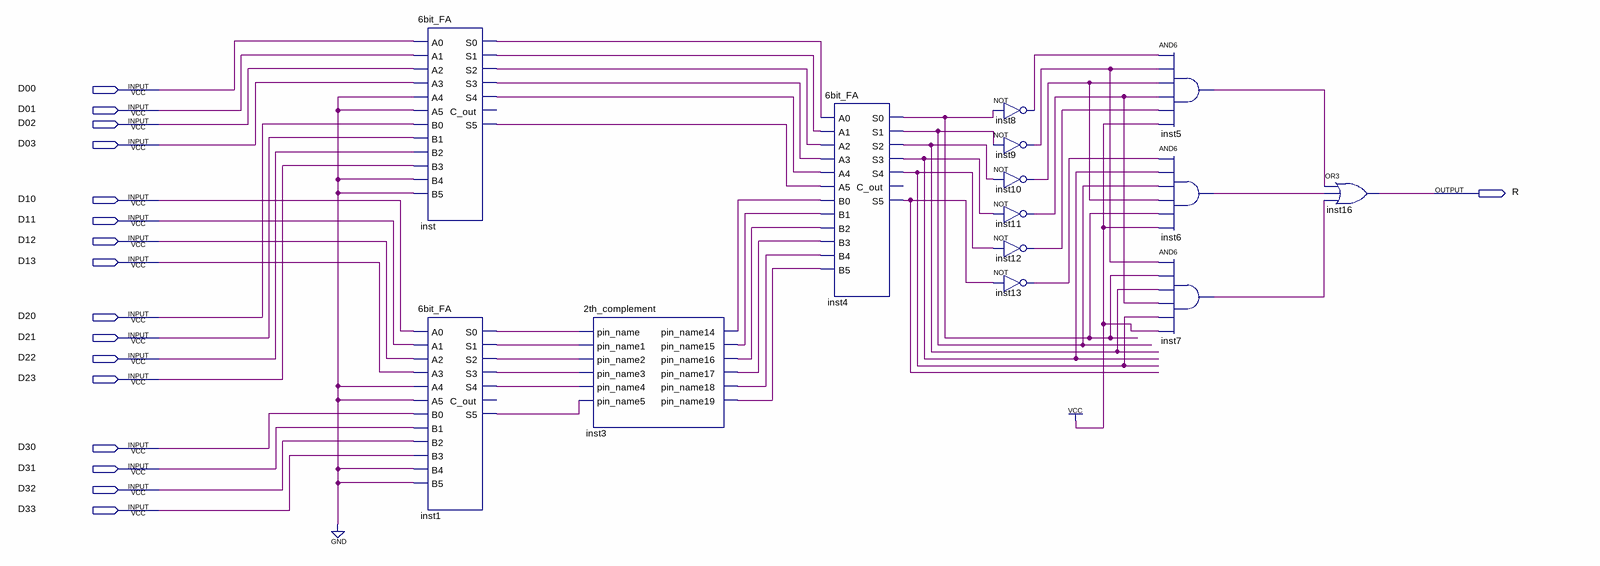
[diagram p0: schematic sheet]
// Quartus schematic Reminder11.bdf as structural Verilog: 14 symbols, 17 pins
module Reminder11 (
  input  D00,
  input  D01,
  input  D02,
  input  D03,
  input  D10,
  input  D11,
  input  D12,
  input  D13,
  input  D20,
  input  D21,
  input  D22,
  input  D23,
  input  D30,
  input  D31,
  input  D32,
  input  D33,
  output R
);

  wire inst1_s0, inst1_s1, inst1_s2, inst1_s3, inst1_s4, inst1_s5, inst3_pin_name14, inst3_pin_name15,
       inst3_pin_name16, inst3_pin_name17, inst3_pin_name18, inst3_pin_name19, inst4_s0, inst4_s1, inst4_s2,
       inst4_s3, inst4_s4, inst4_s5, inst5_out, inst6_out, inst7_out, inst8_out, inst9_out, inst10_out,
       inst11_out, inst12_out, inst13_out, inst_s0, inst_s1, inst_s2, inst_s3, inst_s4, inst_s5;

  \6bit_FA  inst (
    .A0(D00), .A1(D01), .A2(D02), .A3(D03), .A4(1'b0), .A5(1'b0), .B0(D20), .B1(D21), .B2(D22), .B3(D23),
    .B4(1'b0), .B5(1'b0), .S0(inst_s0), .S1(inst_s1), .S2(inst_s2), .S3(inst_s3), .S4(inst_s4), .S5(inst_s5));  // open: C_out
  \6bit_FA  inst1 (
    .A0(D10), .A1(D11), .A2(D12), .A3(D13), .A4(1'b0), .A5(1'b0), .B0(D30), .B1(D31), .B2(D32), .B3(D33),
    .B4(1'b0), .B5(1'b0), .S0(inst1_s0), .S1(inst1_s1), .S2(inst1_s2), .S3(inst1_s3), .S4(inst1_s4),
    .S5(inst1_s5));  // open: C_out
  \2th_complement  inst3 (
    .pin_name(inst1_s0), .pin_name1(inst1_s1), .pin_name2(inst1_s2), .pin_name3(inst1_s3),
    .pin_name4(inst1_s4), .pin_name5(inst1_s5), .pin_name14(inst3_pin_name14), .pin_name15(inst3_pin_name15),
    .pin_name16(inst3_pin_name16), .pin_name17(inst3_pin_name17), .pin_name18(inst3_pin_name18),
    .pin_name19(inst3_pin_name19));
  \6bit_FA  inst4 (
    .A0(inst_s0), .A1(inst_s1), .A2(inst_s2), .A3(inst_s3), .A4(inst_s4), .A5(inst_s5),
    .B0(inst3_pin_name14), .B1(inst3_pin_name15), .B2(inst3_pin_name16), .B3(inst3_pin_name17),
    .B4(inst3_pin_name18), .B5(inst3_pin_name19), .S0(inst4_s0), .S1(inst4_s1), .S2(inst4_s2), .S3(inst4_s3),
    .S4(inst4_s4), .S5(inst4_s5));  // open: C_out
  not inst8 (inst8_out, inst4_s0);
  not inst9 (inst9_out, inst4_s1);
  not inst10 (inst10_out, inst4_s2);
  not inst11 (inst11_out, inst4_s3);
  not inst12 (inst12_out, inst4_s4);
  not inst13 (inst13_out, inst4_s5);
  and inst5 (inst5_out, inst8_out, inst9_out, inst10_out, inst11_out, inst12_out, 1'b1);
  and inst6 (inst6_out, inst13_out, inst4_s3, inst4_s1, inst10_out, inst4_s0, 1'b1);
  and inst7 (inst7_out, inst9_out, inst4_s0, inst4_s2, inst11_out, inst4_s4, 1'b1);
  or inst16 (R, inst5_out, inst6_out, inst7_out);
endmodule
